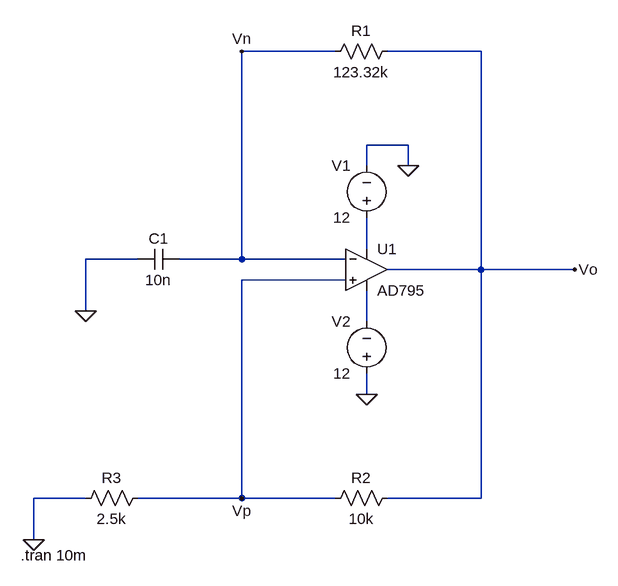
[diagram p0: schematic Schmitt_Trigger_Sim.asc]
Schmitt_Trigger_Sim.asc, the LTspice schematic file:
Version 4
SHEET 1 880 680
WIRE 208 -160 64 -160
WIRE 432 -160 288 -160
WIRE 320 -16 256 -16
WIRE 256 16 256 -16
WIRE 320 16 320 -16
WIRE 256 144 256 96
WIRE -96 160 -176 160
WIRE 64 160 64 -160
WIRE 64 160 -32 160
WIRE 224 160 64 160
WIRE 432 176 432 -160
WIRE 432 176 288 176
WIRE 576 176 432 176
WIRE 224 192 64 192
WIRE -176 240 -176 160
WIRE 256 256 256 208
WIRE 256 368 256 336
WIRE -176 528 -256 528
WIRE 64 528 64 192
WIRE 64 528 -96 528
WIRE 208 528 64 528
WIRE 432 528 432 176
WIRE 432 528 288 528
WIRE -256 592 -256 528
FLAG 320 16 0
FLAG 256 368 0
FLAG -176 240 0
FLAG -256 592 0
FLAG 576 176 Vo
FLAG 64 528 Vp
FLAG 64 -160 Vn
SYMBOL OpAmps\\AD795 256 112 R0
SYMATTR InstName U1
SYMBOL voltage 256 112 R180
WINDOW 0 24 96 Left 2
WINDOW 3 24 16 Left 2
SYMATTR InstName V1
SYMATTR Value 12
SYMBOL voltage 256 352 R180
WINDOW 0 24 96 Left 2
WINDOW 3 24 16 Left 2
SYMATTR InstName V2
SYMATTR Value 12
SYMBOL res 304 -176 R90
WINDOW 0 0 56 VBottom 2
WINDOW 3 32 56 VTop 2
SYMATTR InstName R1
SYMATTR Value 123.32k
SYMBOL res 304 512 R90
WINDOW 0 0 56 VBottom 2
WINDOW 3 32 56 VTop 2
SYMATTR InstName R2
SYMATTR Value 10k
SYMBOL res -80 512 R90
WINDOW 0 0 56 VBottom 2
WINDOW 3 32 56 VTop 2
SYMATTR InstName R3
SYMATTR Value 2.5k
SYMBOL cap -32 144 R90
WINDOW 0 0 32 VBottom 2
WINDOW 3 32 32 VTop 2
SYMATTR InstName C1
SYMATTR Value 10n
TEXT -276 616 Left 2 !.tran 10m

The netlist it stands for:
* Schmitt_Trigger_Sim.asc
XU1 Vp Vn N001 N002 Vo AD795  ; pins In+ In- V+ V- OUT
V1 N001 0 12
V2 0 N002 12
R1 Vo Vn 123.32k
R2 Vo Vp 10k
R3 Vp 0 2.5k
C1 Vn 0 10n
.tran 10m
.lib ADI1.lib
.backanno
.end